# Altium project WCAM-TK-PCB-R02.PrjPcb
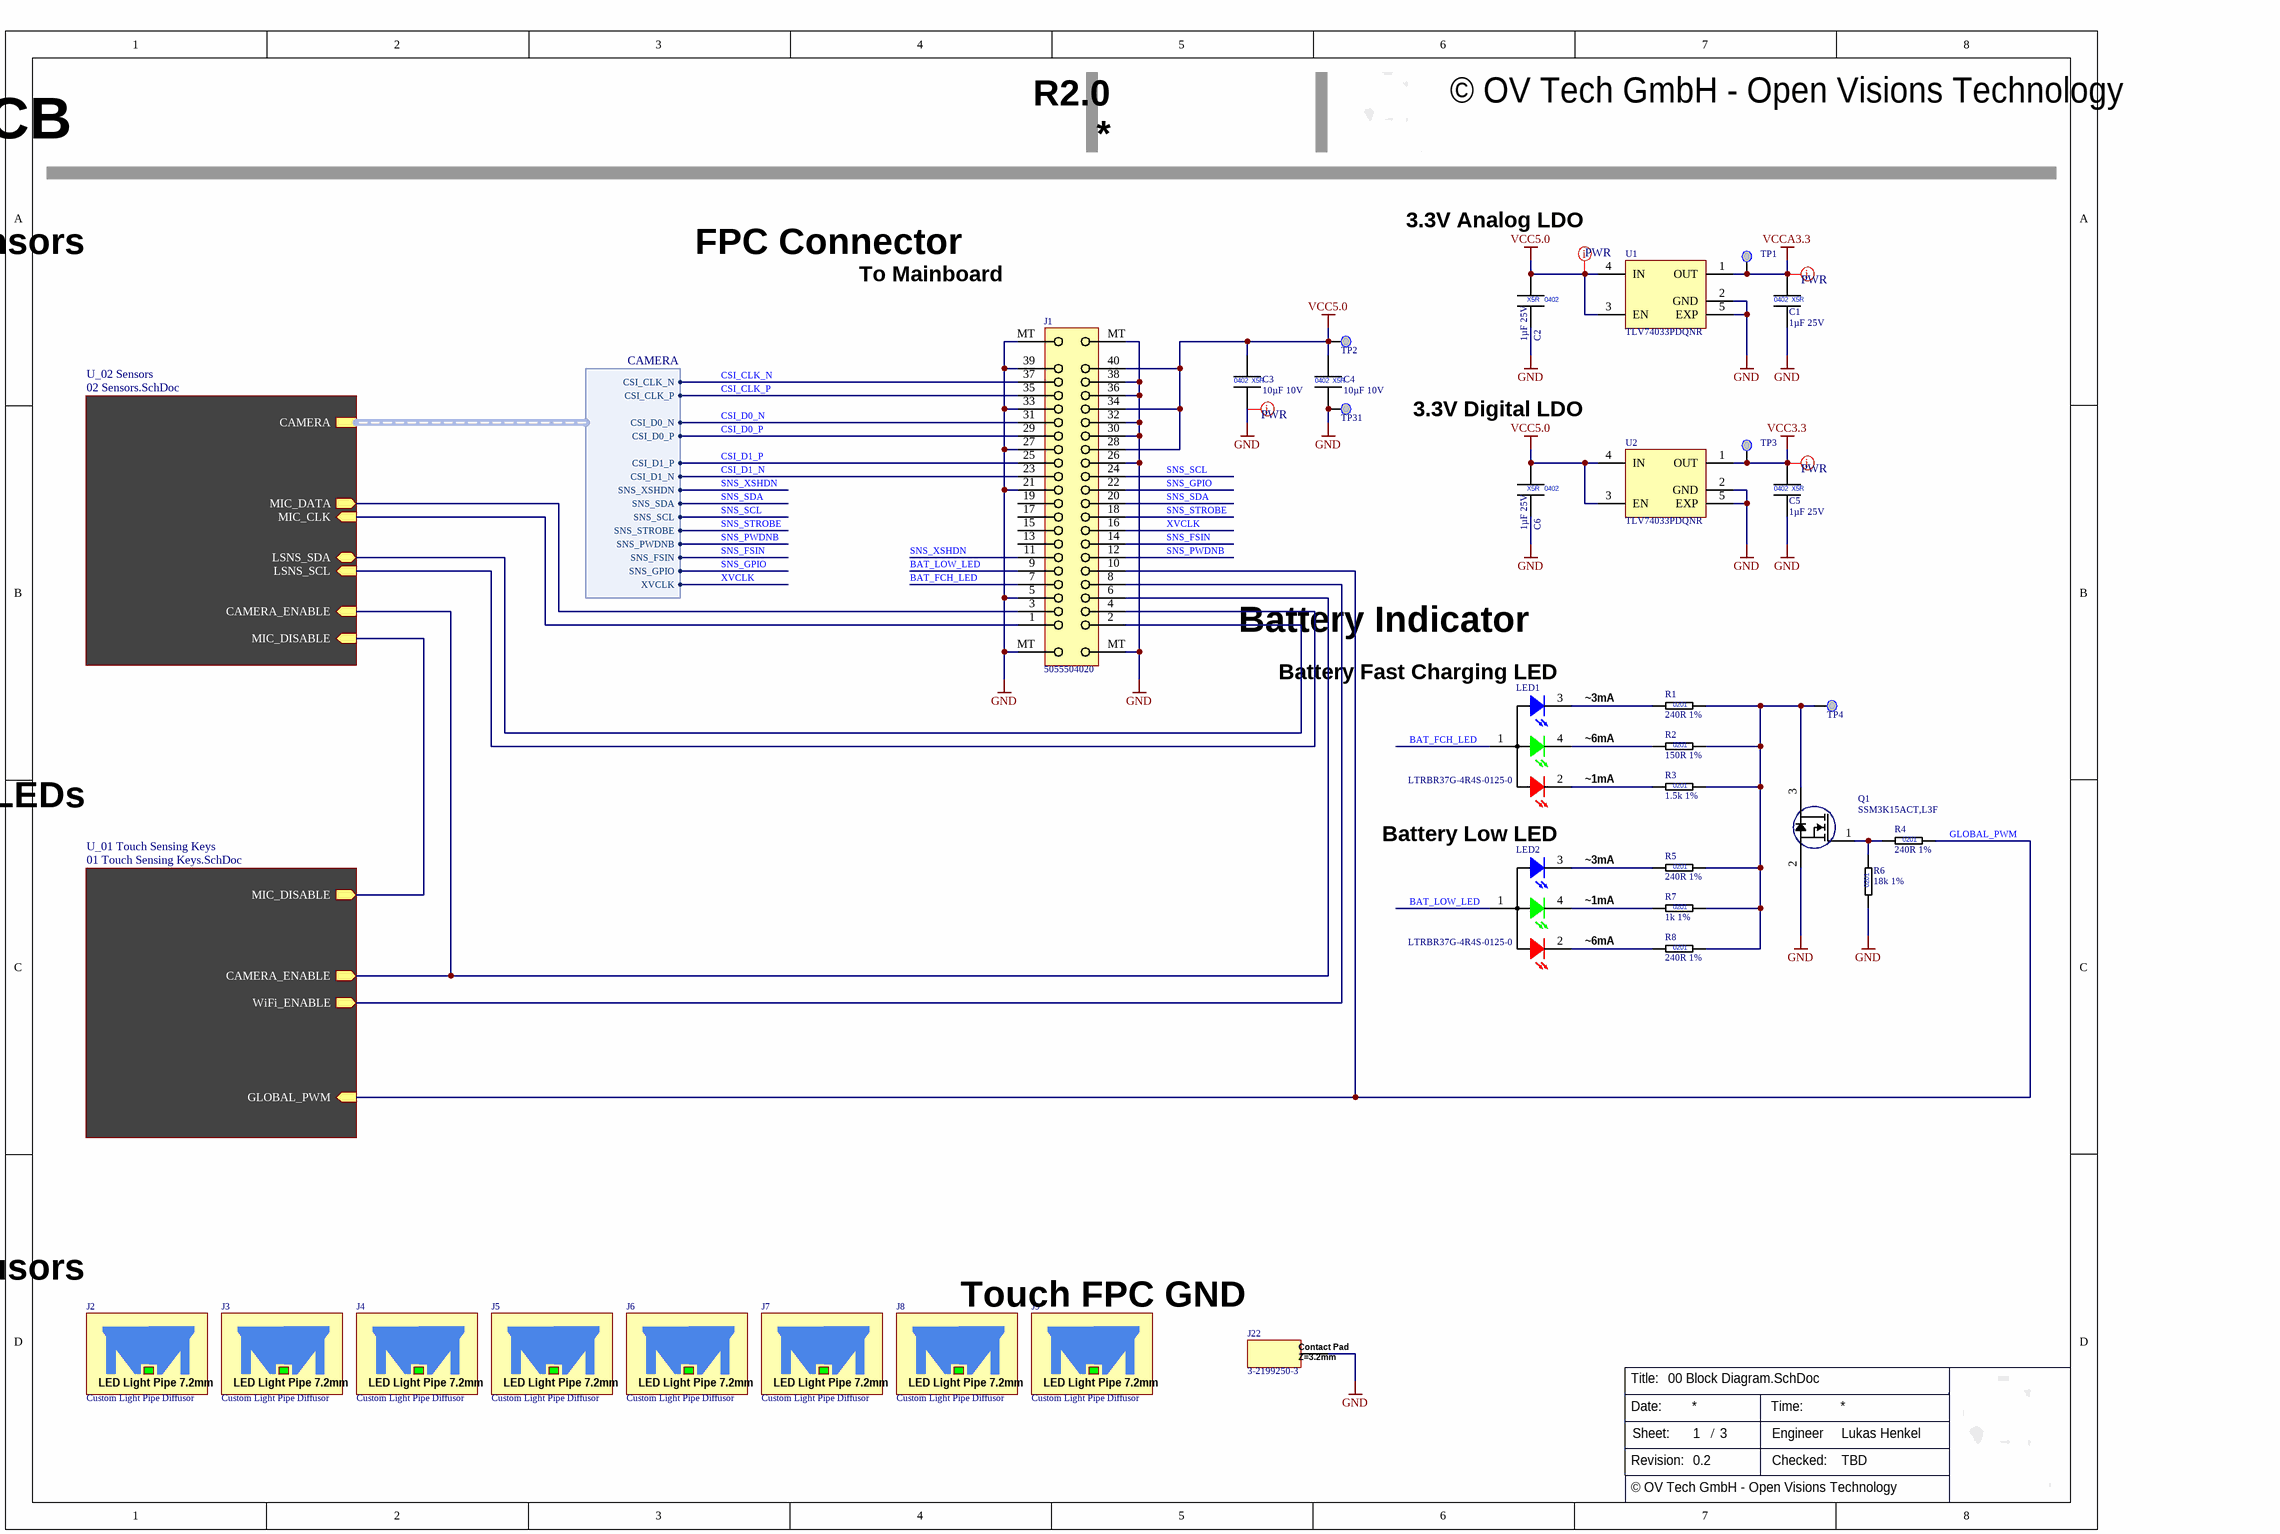
[diagram p0: 00 Block Diagram.SchDoc]
3 sheets, 179 parts. Net scope: hierarchical (ports join the sheet entries above them; power ports are global).
Board files: WCAM-TK-PCB-R02.PcbDoc, WCAM-MOUNT-PCB-R01.PcbDoc, WCAM-TOUCH-FPC-R01.PcbDoc, WCAM-MOUNT-STENCIL-R01.PcbDoc
Sheets:
  00 Block Diagram.SchDoc
    U_01 Touch Sensing Keys = 01 Touch Sensing Keys.SchDoc
    U_02 Sensors = 02 Sensors.SchDoc

## Sheet 00 Block Diagram.SchDoc
size A3; CheckedBy: TBD; Engineer: Lukas Henkel; Revision: 0.2; SheetNumber: 1; SheetTotal: 3

### Parts
C1  1µF 25V  [CAPC1005X06L]
C2  1µF 25V  [CAPC1005X06L]
C3  10µF 10V  [CAPC1005X06L]
C4  10µF 10V  [CAPC1005X06L]
C5  1µF 25V  [CAPC1005X06L]
C6  1µF 25V  [CAPC1005X06L]
J1  5055504020  [BOARD-TO-BOARD 40POL_505550-4020]
J2  Custom Light Pipe Diffusor  [LIGHT_PIPE_DIFFUSOR_CUSTOM]
J3  Custom Light Pipe Diffusor  [LIGHT_PIPE_DIFFUSOR_CUSTOM]
J4  Custom Light Pipe Diffusor  [LIGHT_PIPE_DIFFUSOR_CUSTOM]
J5  Custom Light Pipe Diffusor  [LIGHT_PIPE_DIFFUSOR_CUSTOM]
J6  Custom Light Pipe Diffusor  [LIGHT_PIPE_DIFFUSOR_CUSTOM]
J7  Custom Light Pipe Diffusor  [LIGHT_PIPE_DIFFUSOR_CUSTOM]
J8  Custom Light Pipe Diffusor  [LIGHT_PIPE_DIFFUSOR_CUSTOM]
J9  Custom Light Pipe Diffusor  [LIGHT_PIPE_DIFFUSOR_CUSTOM]
J22  3-2199250-3  [Contact Pad_3.2mm_3-2199250-3]
LED1  LTRBR37G-4R4S-0125-0  [LED 120X120 LTRB R37G RGB]
LED2  LTRBR37G-4R4S-0125-0  [LED 120X120 LTRB R37G RGB]
Q1  SSM3K15ACT,L3F  [DFN65P100X50-3L]
R1  240R 1%  [RESC0603X03L]
R2  150R 1%  [RESC0603X03L]
R3  1.5k 1%  [RESC0603X03L]
R4  240R 1%  [RESC0603X03L]
R5  240R 1%  [RESC0603X03L]
R6  18k 1%  [RESC0603X03L]
R7  1k 1%  [RESC0603X03L]
R8  240R 1%  [RESC0603X03L]
TP1  Testpoint 0.5mm  [TP_0.50mm]  (value not drawn)  (no BOM)
TP2  Testpoint 0.5mm  [TP_0.50mm]  (value not drawn)  (no BOM)
TP3  Testpoint 0.5mm  [TP_0.50mm]  (value not drawn)  (no BOM)
TP4  Testpoint 0.5mm  [TP_0.50mm]  (value not drawn)  (no BOM)
TP31  Testpoint 0.5mm  [TP_0.50mm]  (value not drawn)  (no BOM)
U1  TLV74033PDQNR  [X2SON-DFN]
U2  TLV74033PDQNR  [X2SON-DFN]

### Sub-sheets
U_01 Touch Sensing Keys = 01 Touch Sensing Keys.SchDoc: WiFi_ENABLE (out), MIC_DISABLE (out), GLOBAL_PWM (in), CAMERA_ENABLE (out)
U_02 Sensors = 02 Sensors.SchDoc: MIC_DATA (out), MIC_CLK (in), MIC_DISABLE (in), LSNS_SDA (bidir), LSNS_SCL (in), CAMERA (harness CAMERA), CAMERA_ENABLE (in)

### Harnesses
CAMERA: CSI_D0_N, CSI_D0_P, CSI_D1_N, CSI_D1_P, CSI_CLK_N, CSI_CLK_P, SNS_XSHDN, SNS_SDA, SNS_SCL, SNS_STROBE, SNS_PWDNB, SNS_FSIN, SNS_GPIO, XVCLK

### Nets
GND: C1.2 C2.2 C3.2 C4.2 C5.2 C6.2 J1.5 J1.21 J1.26 J1.27 J1.30 J1.32 J1.33 J1.36 J1.38 J1.39 J1.MT J22.1 Q1.2(S) R6.1 TP31.TP U1.2(GND) U1.5(EXP) U2.2(GND) U2.5(EXP)
VCC3.3: C5.1 TP3.TP U2.1(OUT)
VCC5.0: C2.1 C3.1 C4.1 C6.1 J1.28 J1.34 J1.40 TP2.TP U1.3(EN) U1.4(IN) U2.3(EN) U2.4(IN)
VCCA3.3: C1.1 TP1.TP U1.1(OUT)
BAT_FCH_LED: J1.7 LED1.1
BAT_LOW_LED: J1.9 LED2.1
CAMERA_ENABLE: J1.6 ; sheet U_01 Touch Sensing Keys/CAMERA_ENABLE, sheet U_02 Sensors/CAMERA_ENABLE
CSI_CLK_N: J1.37 ; sheet U_02 Sensors/CAMERA.CSI_CLK_N
CSI_CLK_P: J1.35 ; sheet U_02 Sensors/CAMERA.CSI_CLK_P
CSI_D0_N: J1.31 ; sheet U_02 Sensors/CAMERA.CSI_D0_N
CSI_D0_P: J1.29 ; sheet U_02 Sensors/CAMERA.CSI_D0_P
CSI_D1_N: J1.23 ; sheet U_02 Sensors/CAMERA.CSI_D1_N
CSI_D1_P: J1.25 ; sheet U_02 Sensors/CAMERA.CSI_D1_P
GLOBAL_PWM: J1.10 R4.2 ; sheet U_01 Touch Sensing Keys/GLOBAL_PWM
LSNS_SCL: J1.4 ; sheet U_02 Sensors/LSNS_SCL
LSNS_SDA: J1.2 ; sheet U_02 Sensors/LSNS_SDA
MIC_DISABLE: sheet U_01 Touch Sensing Keys/MIC_DISABLE, sheet U_02 Sensors/MIC_DISABLE
SNS_FSIN: J1.14 ; sheet U_02 Sensors/CAMERA.SNS_FSIN
SNS_GPIO: J1.22 ; sheet U_02 Sensors/CAMERA.SNS_GPIO
SNS_PWDNB: J1.12 ; sheet U_02 Sensors/CAMERA.SNS_PWDNB
SNS_SCL: J1.24 ; sheet U_02 Sensors/CAMERA.SNS_SCL
SNS_SDA: J1.20 ; sheet U_02 Sensors/CAMERA.SNS_SDA
SNS_STROBE: J1.18 ; sheet U_02 Sensors/CAMERA.SNS_STROBE
SNS_XSHDN: J1.11 ; sheet U_02 Sensors/CAMERA.SNS_XSHDN
WiFi_ENABLE: J1.8 ; sheet U_01 Touch Sensing Keys/WiFi_ENABLE
XVCLK: J1.16 ; sheet U_02 Sensors/CAMERA.XVCLK
NetJ1_1: J1.1 ; sheet U_02 Sensors/MIC_CLK
NetJ1_3: J1.3 ; sheet U_02 Sensors/MIC_DATA
NetLED1_2: LED1.2 R3.1
NetLED1_3: LED1.3 R1.1
NetLED1_4: LED1.4 R2.1
NetLED2_2: LED2.2 R8.1
NetLED2_3: LED2.3 R5.1
NetLED2_4: LED2.4 R7.1
NetQ1_1: Q1.1(G) R4.1 R6.2
NetQ1_3: Q1.3(D) R1.2 R2.2 R3.2 R5.2 R7.2 R8.2 TP4.TP

Not connected (* = marked no-connect by the designer): J1 13 15 17 19

### Layout directives
net class PWR: GND, VCC3.3, VCC5.0, VCCA3.3

### Notes on the sheet
- R2.0
- Webcam and TouchKey PCB
- © OV Tech GmbH - Open Visions Technology
- 3.3V Analog LDO
- Sensors
- FPC Connector
- To Mainboard
- 3.3V Digital LDO
- Battery Indicator
- Battery Fast Charging LED
- ~3mA
- ~6mA
- Touch Keys w. LEDs
- ~1mA
- Battery Low LED
- LED Diffusors
- (near J22) Touch FPC GND
- Title:
- Date:
- Time:
- Revision:
- Sheet:
- /
- Engineer
- Checked:
- (in symbol CAP_0402_1µ_25V) 0402; X5R
- (in symbol CAP_0402_10µ_10V) 0402; X5R
- (in symbol LIGHT PIPE_CUSTOM_DIFFUSOR) LED Light Pipe 7.2mm
- (in symbol PAD_3-2199250-3) Contact Pad; Z=3.2mm
- (in symbol RES_0201_1.5k_1%) 0201
- (in symbol RES_0201_1k_1%) 0201
- (in symbol RES_0201_18k_1%) 0201
- (in symbol RES_0201_150R_1%) 0201
- (in symbol RES_0201_240R_1%) 0201

### Library data of the parts
C1 C2 C5 C6 = CAP_0402_1µ_25V: Multilayer Ceramic Capacitors MLCC - SMD/SMT 0402 25VDC; Manufacturer 1: Murata Electronics; Manufacturer 1 Prt. Nr.: GRM155R61E105KE11D; Manufacturer 2 Prt. Nr.: 0402X105K250CT; Manufacturer 2: Walsin
C3 C4 = CAP_0402_10µ_10V: Multilayer Ceramic Capacitors MLCC - SMD/SMT 0402 10VDC; Manufacturer 1: Murata Electronics; Manufacturer 1 Prt. Nr.: GRM155R61A475MEAAD; Manufacturer 2 Prt. Nr.: LMK105BBJ475MVLF; Manufacturer 2: Taiyo Yuden
J1 = Board to Board Connector_5055504020: Board to Board connector 40Pol Stacking Header 0.4mm Pitch; Manufacturer 1: Molex; Manufacturer 1 Prt. Nr.: 505550-4020
J2-J9 = LIGHT PIPE_CUSTOM_DIFFUSOR: Low Profile LED light pipe diffusor; Manufacturer 1: OV Tech; Manufacturer 1 Prt. Nr.: Light Pipe 7.2mm
J22 = PAD_3-2199250-3: SMD Contact pad spring loaded 3.2mm; Manufacturer 1: TE Connectivity; Manufacturer 1 Prt. Nr.: 3-2199250-3
LED1 LED2 = LED RGB Low Profile_LTRBR37G-4R4S-0125-0: Micro LED Ultra Low Profile 1.2mm X 1.2mm X 0.25mm LTRBR37G; Manufacturer 1: ams OSRAM; Manufacturer 1 Prt. Nr.: LTRBR37G-4R4S-0125-0
Q1 = N-Channel MOSFET_SSM3K15ACT,L3F: MOSFET 30V SGL N-CH TRENCHMOS Logic Level; Manufacturer 1: Toshiba; Manufacturer 1 Prt. Nr.: SSM3K15ACT,L3F
R1 R4 R5 R8 = RES_0201_240R_1%: Thick Film Resistors - SMD 240 OHM 1%; Manufacturer 1: Yageo; Manufacturer 1 Prt. Nr.: RC0201FR-07240RL; Manufacturer 2 Prt. Nr.: CRCW0201240RFNED; Manufacturer 2: Vishay / Dale
R2 = RES_0201_150R_1%: Thick Film Resistors - SMD 150 OHM 1%; Manufacturer 1: Yageo; Manufacturer 1 Prt. Nr.: RC0201FR-07150RL; Manufacturer 2 Prt. Nr.: CRCW0201150RFNED; Manufacturer 2: Vishay / Dale
R3 = RES_0201_1.5k_1%: Thick Film Resistors - SMD 1.5K OHM 1%; Manufacturer 1: Yageo; Manufacturer 1 Prt. Nr.: RC0201FR-071K5L; Manufacturer 2 Prt. Nr.: CRCW02011K50FNED; Manufacturer 2: Vishay / Dale
R6 = RES_0201_18k_1%: Thick Film Resistors - SMD 18K OHM 1%; Manufacturer 1: Panasonic; Manufacturer 1 Prt. Nr.: ERJ-1GNF1802C; Manufacturer 2 Prt. Nr.: RK73H1HTTC1802F; Manufacturer 2: KOA Speer
R7 = RES_0201_1k_1%: Thick Film Resistors - SMD 1K OHM 1%; Manufacturer 1: Yageo; Manufacturer 1 Prt. Nr.: RC0201FR-071KL; Manufacturer 2 Prt. Nr.: CRCW02011K00FNED; Manufacturer 2: Vishay / Dale
U1 U2 = LDO 3.3V_TLV74033PDQNR: LDO voltage regulator 300mA X2SON; Manufacturer 1: Texas Instruments; Manufacturer 1 Prt. Nr.: TLV74033PDQNR

## Sheet 01 Touch Sensing Keys.SchDoc
size A3; CheckedBy: TBD; Engineer: Lukas Henkel; Revision: 0.2; SheetNumber: 2; SheetTotal: 3
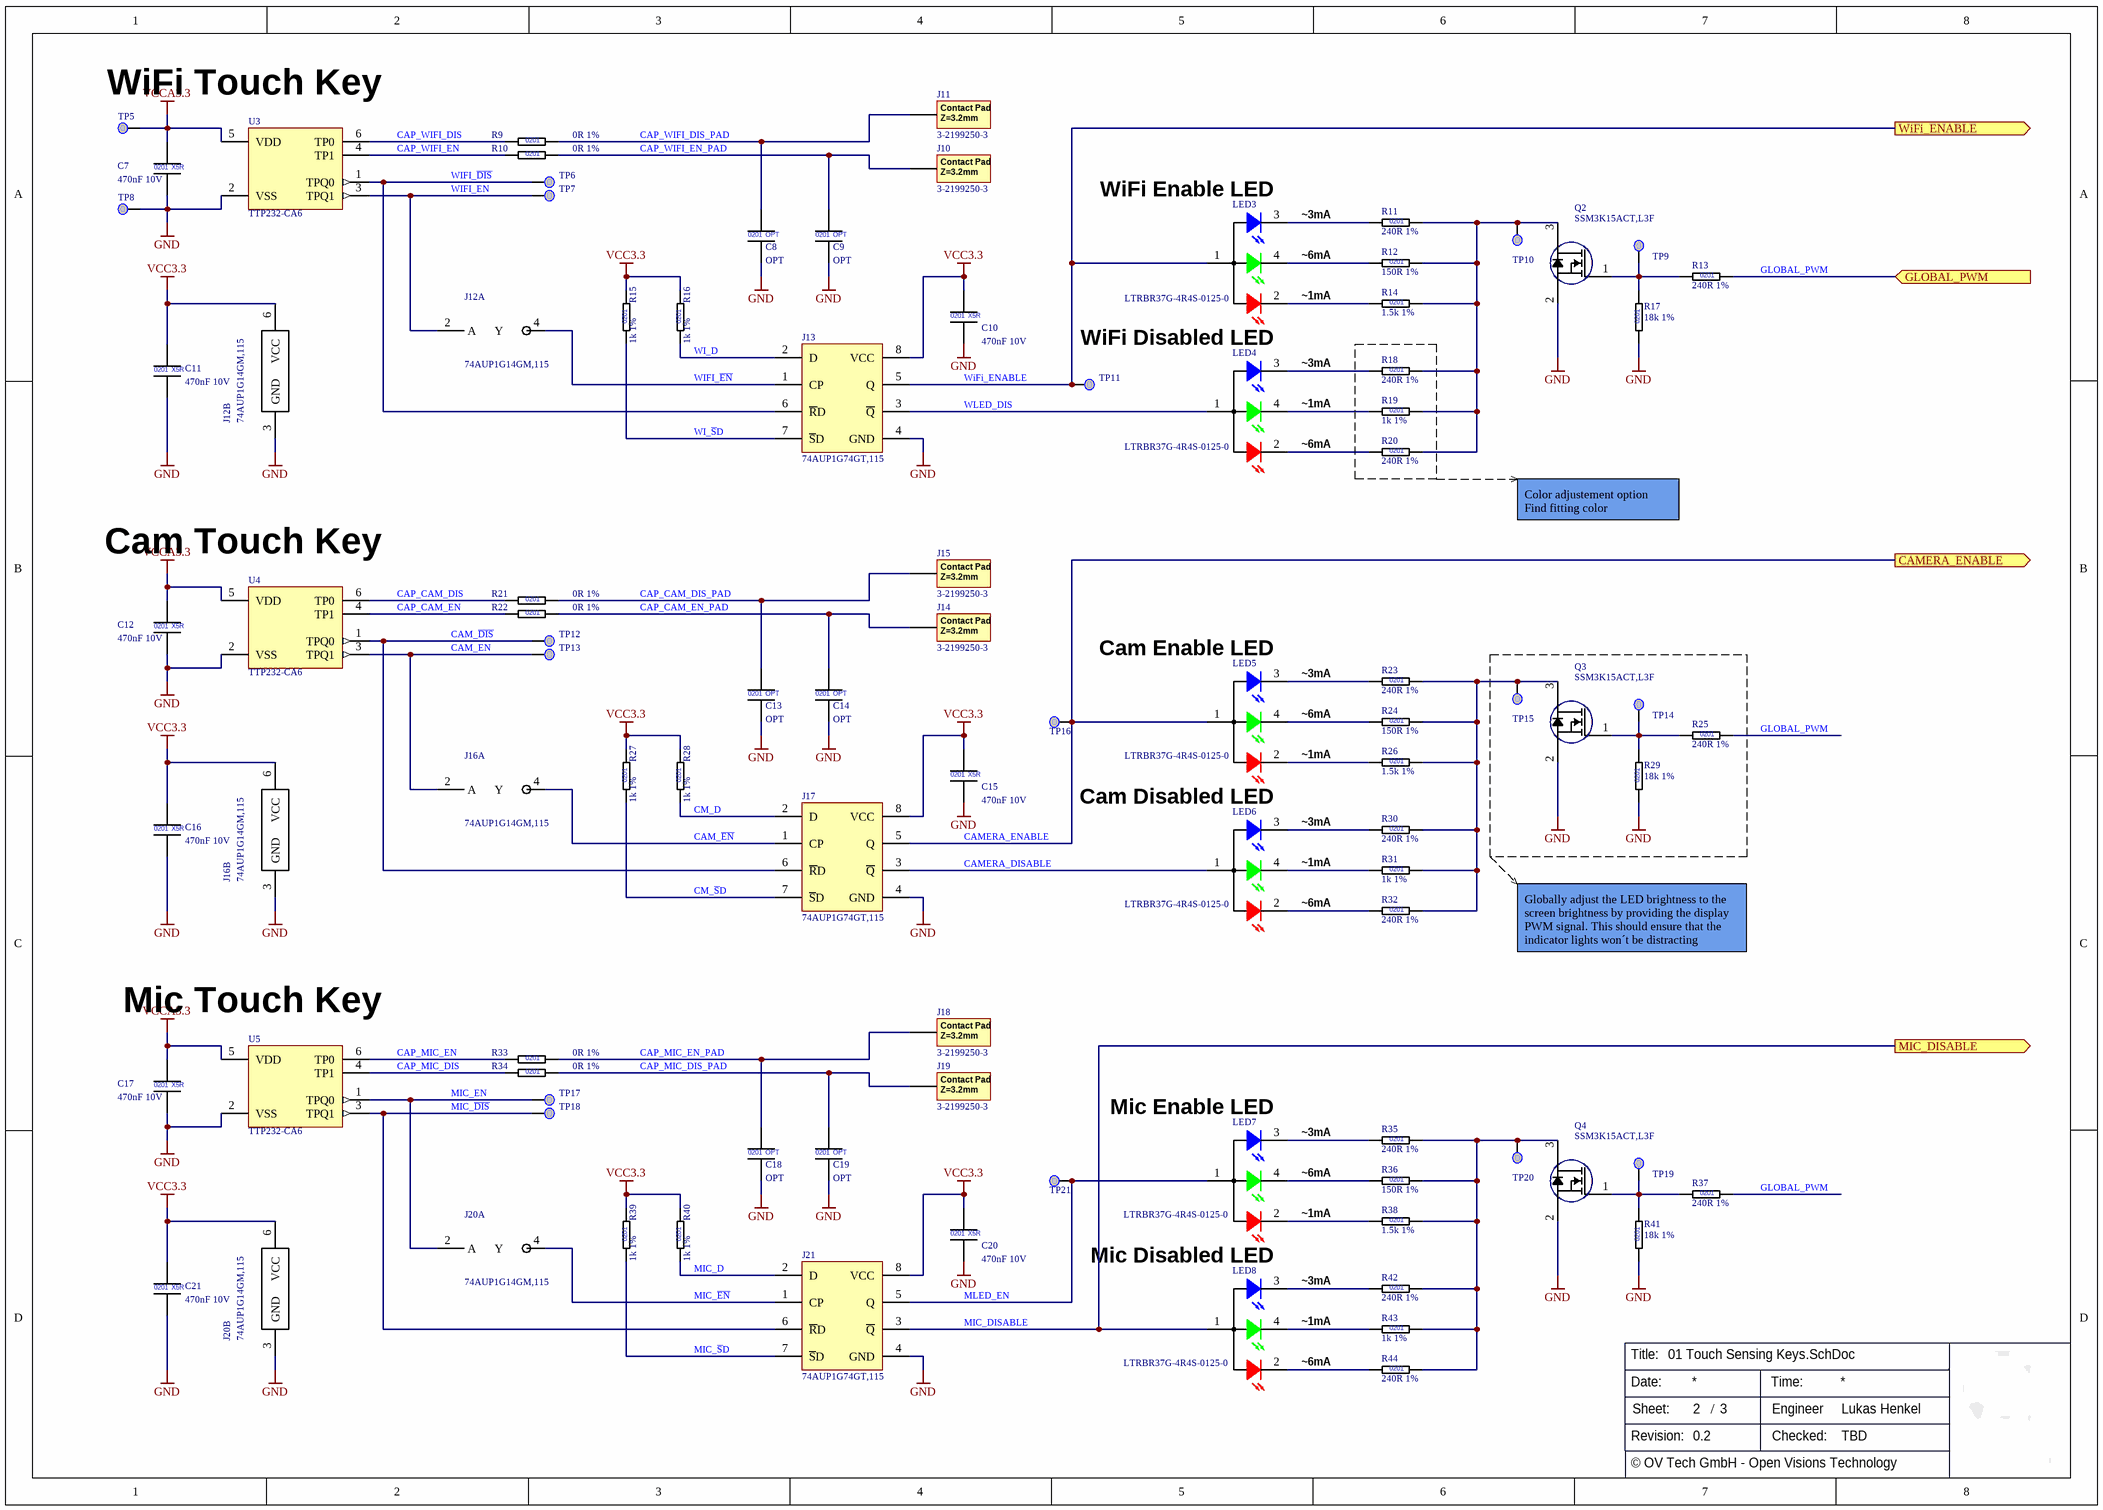
[diagram p1: 01 Touch Sensing Keys.SchDoc]

### Parts
C7  470nF 10V  [CAPC0603X03L]
C8  OPT  [CAPC0603X03L]  (no BOM)
C9  OPT  [CAPC0603X03L]  (no BOM)
C10  470nF 10V  [CAPC0603X03L]
C11  470nF 10V  [CAPC0603X03L]
C12  470nF 10V  [CAPC0603X03L]
C13  OPT  [CAPC0603X03L]  (no BOM)
C14  OPT  [CAPC0603X03L]  (no BOM)
C15  470nF 10V  [CAPC0603X03L]
C16  470nF 10V  [CAPC0603X03L]
C17  470nF 10V  [CAPC0603X03L]
C18  OPT  [CAPC0603X03L]  (no BOM)
C19  OPT  [CAPC0603X03L]  (no BOM)
C20  470nF 10V  [CAPC0603X03L]
C21  470nF 10V  [CAPC0603X03L]
J10  3-2199250-3  [Contact Pad_3.2mm_3-2199250-3]
J11  3-2199250-3  [Contact Pad_3.2mm_3-2199250-3]
J12  74AUP1G14GM,115  [PSON50P140X100X50-6L]  (parts A,B of 2)
J13  74AUP1G74GT,115  [PSON50P100X50-8L]
J14  3-2199250-3  [Contact Pad_3.2mm_3-2199250-3]
J15  3-2199250-3  [Contact Pad_3.2mm_3-2199250-3]
J16  74AUP1G14GM,115  [PSON50P140X100X50-6L]  (parts A,B of 2)
J17  74AUP1G74GT,115  [PSON50P100X50-8L]
J18  3-2199250-3  [Contact Pad_3.2mm_3-2199250-3]
J19  3-2199250-3  [Contact Pad_3.2mm_3-2199250-3]
J20  74AUP1G14GM,115  [PSON50P140X100X50-6L]  (parts A,B of 2)
J21  74AUP1G74GT,115  [PSON50P100X50-8L]
LED3  LTRBR37G-4R4S-0125-0  [LED 120X120 LTRB R37G RGB]
LED4  LTRBR37G-4R4S-0125-0  [LED 120X120 LTRB R37G RGB]
LED5  LTRBR37G-4R4S-0125-0  [LED 120X120 LTRB R37G RGB]
LED6  LTRBR37G-4R4S-0125-0  [LED 120X120 LTRB R37G RGB]
LED7  LTRBR37G-4R4S-0125-0  [LED 120X120 LTRB R37G RGB]
LED8  LTRBR37G-4R4S-0125-0  [LED 120X120 LTRB R37G RGB]
Q2  SSM3K15ACT,L3F  [DFN65P100X50-3L]
Q3  SSM3K15ACT,L3F  [DFN65P100X50-3L]
Q4  SSM3K15ACT,L3F  [DFN65P100X50-3L]
R9  0R 1%  [RESC0603X03L]
R10  0R 1%  [RESC0603X03L]
R11  240R 1%  [RESC0603X03L]
R12  150R 1%  [RESC0603X03L]
R13  240R 1%  [RESC0603X03L]
R14  1.5k 1%  [RESC0603X03L]
R15  1k 1%  [RESC0603X03L]
R16  1k 1%  [RESC0603X03L]
R17  18k 1%  [RESC0603X03L]
R18  240R 1%  [RESC0603X03L]
R19  1k 1%  [RESC0603X03L]
R20  240R 1%  [RESC0603X03L]
R21  0R 1%  [RESC0603X03L]
R22  0R 1%  [RESC0603X03L]
R23  240R 1%  [RESC0603X03L]
R24  150R 1%  [RESC0603X03L]
R25  240R 1%  [RESC0603X03L]
R26  1.5k 1%  [RESC0603X03L]
R27  1k 1%  [RESC0603X03L]
R28  1k 1%  [RESC0603X03L]
R29  18k 1%  [RESC0603X03L]
R30  240R 1%  [RESC0603X03L]
R31  1k 1%  [RESC0603X03L]
R32  240R 1%  [RESC0603X03L]
R33  0R 1%  [RESC0603X03L]
R34  0R 1%  [RESC0603X03L]
R35  240R 1%  [RESC0603X03L]
R36  150R 1%  [RESC0603X03L]
R37  240R 1%  [RESC0603X03L]
R38  1.5k 1%  [RESC0603X03L]
R39  1k 1%  [RESC0603X03L]
R40  1k 1%  [RESC0603X03L]
R41  18k 1%  [RESC0603X03L]
R42  240R 1%  [RESC0603X03L]
R43  1k 1%  [RESC0603X03L]
R44  240R 1%  [RESC0603X03L]
TP5  Testpoint 0.5mm  [TP_0.50mm]  (value not drawn)  (no BOM)
TP6  Testpoint 0.5mm  [TP_0.50mm]  (value not drawn)  (no BOM)
TP7  Testpoint 0.5mm  [TP_0.50mm]  (value not drawn)  (no BOM)
TP8  Testpoint 0.5mm  [TP_0.50mm]  (value not drawn)  (no BOM)
TP9  Testpoint 0.5mm  [TP_0.50mm]  (value not drawn)  (no BOM)
TP10  Testpoint 0.5mm  [TP_0.50mm]  (value not drawn)  (no BOM)
TP11  Testpoint 0.5mm  [TP_0.50mm]  (value not drawn)  (no BOM)
TP12  Testpoint 0.5mm  [TP_0.50mm]  (value not drawn)  (no BOM)
TP13  Testpoint 0.5mm  [TP_0.50mm]  (value not drawn)  (no BOM)
TP14  Testpoint 0.5mm  [TP_0.50mm]  (value not drawn)  (no BOM)
TP15  Testpoint 0.5mm  [TP_0.50mm]  (value not drawn)  (no BOM)
TP16  Testpoint 0.5mm  [TP_0.50mm]  (value not drawn)  (no BOM)
TP17  Testpoint 0.5mm  [TP_0.50mm]  (value not drawn)  (no BOM)
TP18  Testpoint 0.5mm  [TP_0.50mm]  (value not drawn)  (no BOM)
TP19  Testpoint 0.5mm  [TP_0.50mm]  (value not drawn)  (no BOM)
TP20  Testpoint 0.5mm  [TP_0.50mm]  (value not drawn)  (no BOM)
TP21  Testpoint 0.5mm  [TP_0.50mm]  (value not drawn)  (no BOM)
U3  TTP232-CA6  [SOT95P285X126-6L]
U4  TTP232-CA6  [SOT95P285X126-6L]
U5  TTP232-CA6  [SOT95P285X126-6L]

### Ports
CAMERA_ENABLE (out), GLOBAL_PWM (in), MIC_DISABLE (out), WiFi_ENABLE (out)

### Nets
GND: C7.2 C8.2 C9.2 C10.2 C11.2 C12.2 C13.2 C14.2 C15.2 C16.2 C17.2 C18.2 C19.2 C20.2 C21.2 J12.3(GND) J13.4(GND) J16.3(GND) J17.4(GND) J20.3(GND) J21.4(GND) Q2.2(S) Q3.2(S) Q4.2(S) R17.1 R29.1 R41.1 TP8.TP U3.2(VSS) U4.2(VSS) U5.2(VSS)
VCC3.3: C10.1 C11.1 C15.1 C16.1 C20.1 C21.1 J12.6(VCC) J13.8(VCC) J16.6(VCC) J17.8(VCC) J20.6(VCC) J21.8(VCC) R15.2 R16.2 R27.2 R28.2 R39.2 R40.2
VCCA3.3: C7.1 C12.1 C17.1 TP5.TP U3.5(VDD) U4.5(VDD) U5.5(VDD)
CAM_~{DIS}: J17.6(~{R}D) TP12.TP U4.1(TPQ0)
CAM_~{EN}: J16.4(Y) J17.1(CP)
CAM_EN: J16.2(A) TP13.TP U4.3(TPQ1)
CAMERA_DISABLE: J17.3(~{Q}) LED6.1
CAMERA_ENABLE: J17.5(Q) LED5.1 TP16.TP ; port CAMERA_ENABLE
CAP_CAM_DIS: R21.1 U4.6(TP0)
CAP_CAM_DIS_PAD: C13.1 J15.1 R21.2
CAP_CAM_EN: R22.1 U4.4(TP1)
CAP_CAM_EN_PAD: C14.1 J14.1 R22.2
CAP_MIC_DIS: R34.1 U5.4(TP1)
CAP_MIC_DIS_PAD: C19.1 J19.1 R34.2
CAP_MIC_EN: R33.1 U5.6(TP0)
CAP_MIC_EN_PAD: C18.1 J18.1 R33.2
CAP_WIFI_DIS: R9.1 U3.6(TP0)
CAP_WIFI_DIS_PAD: C8.1 J11.1 R9.2
CAP_WIFI_EN: R10.1 U3.4(TP1)
CAP_WIFI_EN_PAD: C9.1 J10.1 R10.2
CM_D: J17.2(D) R28.1
CM_~{S}D: J17.7(~{S}D) R27.1
GLOBAL_PWM: R13.2 R25.2 R37.2 ; port GLOBAL_PWM
MIC_D: J21.2(D) R40.1
MIC_~{DIS}: J21.6(~{R}D) TP18.TP U5.3(TPQ1)
MIC_DISABLE: J21.3(~{Q}) LED8.1 ; port MIC_DISABLE
MIC_~{EN}: J20.4(Y) J21.1(CP)
MIC_EN: J20.2(A) TP17.TP U5.1(TPQ0)
MIC_~{S}D: J21.7(~{S}D) R39.1
MLED_EN: J21.5(Q) LED7.1 TP21.TP
WI_D: J13.2(D) R16.1
WI_~{S}D: J13.7(~{S}D) R15.1
WIFI_~{DIS}: J13.6(~{R}D) TP6.TP U3.1(TPQ0)
WIFI_~{EN}: J12.4(Y) J13.1(CP)
WIFI_EN: J12.2(A) TP7.TP U3.3(TPQ1)
WiFi_ENABLE: J13.5(Q) LED3.1 TP11.TP ; port WiFi_ENABLE
WLED_DIS: J13.3(~{Q}) LED4.1
NetLED3_2: LED3.2 R14.1
NetLED3_3: LED3.3 R11.1
NetLED3_4: LED3.4 R12.1
NetLED4_2: LED4.2 R20.1
NetLED4_3: LED4.3 R18.1
NetLED4_4: LED4.4 R19.1
NetLED5_2: LED5.2 R26.1
NetLED5_3: LED5.3 R23.1
NetLED5_4: LED5.4 R24.1
NetLED6_2: LED6.2 R32.1
NetLED6_3: LED6.3 R30.1
NetLED6_4: LED6.4 R31.1
NetLED7_2: LED7.2 R38.1
NetLED7_3: LED7.3 R35.1
NetLED7_4: LED7.4 R36.1
NetLED8_2: LED8.2 R44.1
NetLED8_3: LED8.3 R42.1
NetLED8_4: LED8.4 R43.1
NetQ2_1: Q2.1(G) R13.1 R17.2 TP9.TP
NetQ2_3: Q2.3(D) R11.2 R12.2 R14.2 R18.2 R19.2 R20.2 TP10.TP
NetQ3_1: Q3.1(G) R25.1 R29.2 TP14.TP
NetQ3_3: Q3.3(D) R23.2 R24.2 R26.2 R30.2 R31.2 R32.2 TP15.TP
NetQ4_1: Q4.1(G) R37.1 R41.2 TP19.TP
NetQ4_3: Q4.3(D) R35.2 R36.2 R38.2 R42.2 R43.2 R44.2 TP20.TP

### Notes on the sheet
- WiFi Touch Key
- WiFi Enable LED
- ~3mA
- WiFi Disabled LED
- ~6mA
- ~1mA
- Cam Touch Key
- Color adjustement option
  Find fitting color experimentally
- Cam Enable LED
- Cam Disabled LED
- Mic Touch Key
- Globally adjust the LED brightness to the screen brightness by providing the display PWM signal. This should ensure that the indicator lights won´t be distracting
- Mic Enable LED
- Mic Disabled LED
- Title:
- Date:
- Time:
- Revision:
- Sheet:
- /
- Engineer
- Checked:
- © OV Tech GmbH - Open Visions Technology
- (in symbol CAP_0201_470nF_10V) 0201; X5R
- (in symbol CAP_0201_OPT) 0201
- (in symbol PAD_3-2199250-3) Contact Pad; Z=3.2mm
- (in symbol RES_0201_0R_1%) 0201
- (in symbol RES_0201_1.5k_1%) 0201
- (in symbol RES_0201_1k_1%) 0201
- (in symbol RES_0201_18k_1%) 0201
- (in symbol RES_0201_150R_1%) 0201
- (in symbol RES_0201_240R_1%) 0201

### Library data of the parts
C7 C10-C12 C15-C17 C20 C21 = CAP_0201_470nF_10V: Multilayer Ceramic Capacitors MLCC - SMD/SMT 0201 10VDC; Manufacturer 1: Taiyo Yuden; Manufacturer 1 Prt. Nr.: LMK063BBJ474KPLF; Manufacturer 2 Prt. Nr.: C0603X5R1A474M030BC; Manufacturer 2: TDK
C8 C9 C13 C14 C18 C19 = CAP_0201_OPT: Optional Capacitor 0201
J10 J11 J14 J15 J18 J19 = PAD_3-2199250-3: as J22 on sheet 00 Block Diagram; Manufacturer 1 Prt. Nr.: 3-2199250-3
J12 J16 J20 = Inverter_74AUP1G14GM,115: Single Unbuffered Inverter 74AUP1G14GM,115; Manufacturer 1: Nexperia; Manufacturer 1 Prt. Nr.: 74AUP1G14GM,115
J13 J17 J21 = D-FLOP_SMG-W-2,0x1,2x1,25-AU: D-type flip-flop with differential output and async set- and reset input; Manufacturer 1: Nexperia; Manufacturer 1 Prt. Nr.: 74AUP1G74GT,115
LED3-LED8 = LED RGB Low Profile_LTRBR37G-4R4S-0125-0: as LED1 on sheet 00 Block Diagram; Manufacturer 1 Prt. Nr.: LTRBR37G-4R4S-0125-0
Q2-Q4 = N-Channel MOSFET_SSM3K15ACT,L3F: as Q1 on sheet 00 Block Diagram; Manufacturer 1 Prt. Nr.: SSM3K15ACT,L3F
R9 R10 R21 R22 R33 R34 = RES_0201_0R_1%: Thick Film Resistors - SMD 0R OHM 1%; Manufacturer 1: Yageo; Manufacturer 1 Prt. Nr.: RC0201FR-070RL; Manufacturer 2 Prt. Nr.: CRCW02010000Z0ED; Manufacturer 2: Vishay / Dale
R11 R13 R18 R20 R23 R25 R30 R32 R35 R37 R42 R44 = RES_0201_240R_1%: as R1 on sheet 00 Block Diagram; Manufacturer 2: Vishay / Dale
R12 R24 R36 = RES_0201_150R_1%: as R2 on sheet 00 Block Diagram; Manufacturer 2: Vishay / Dale
R14 R26 R38 = RES_0201_1.5k_1%: as R3 on sheet 00 Block Diagram; Manufacturer 2: Vishay / Dale
R15 R16 R19 R27 R28 R31 R39 R40 R43 = RES_0201_1k_1%: as R7 on sheet 00 Block Diagram; Manufacturer 2: Vishay / Dale
R17 R29 R41 = RES_0201_18k_1%: as R6 on sheet 00 Block Diagram; Manufacturer 2: KOA Speer
U3-U5 = Dual key capacitive touch sensing_TTP232-CA6: Two key touch pad detector IC TTP232-CA6; Manufacturer 1: Tontek Design Tech; Manufacturer 1 Prt. Nr.: TTP232-CA6

## Sheet 02 Sensors.SchDoc
size A3; CheckedBy: TBD; Engineer: Lukas Henkel; Revision: 0.2; SheetNumber: 3; SheetTotal: 3
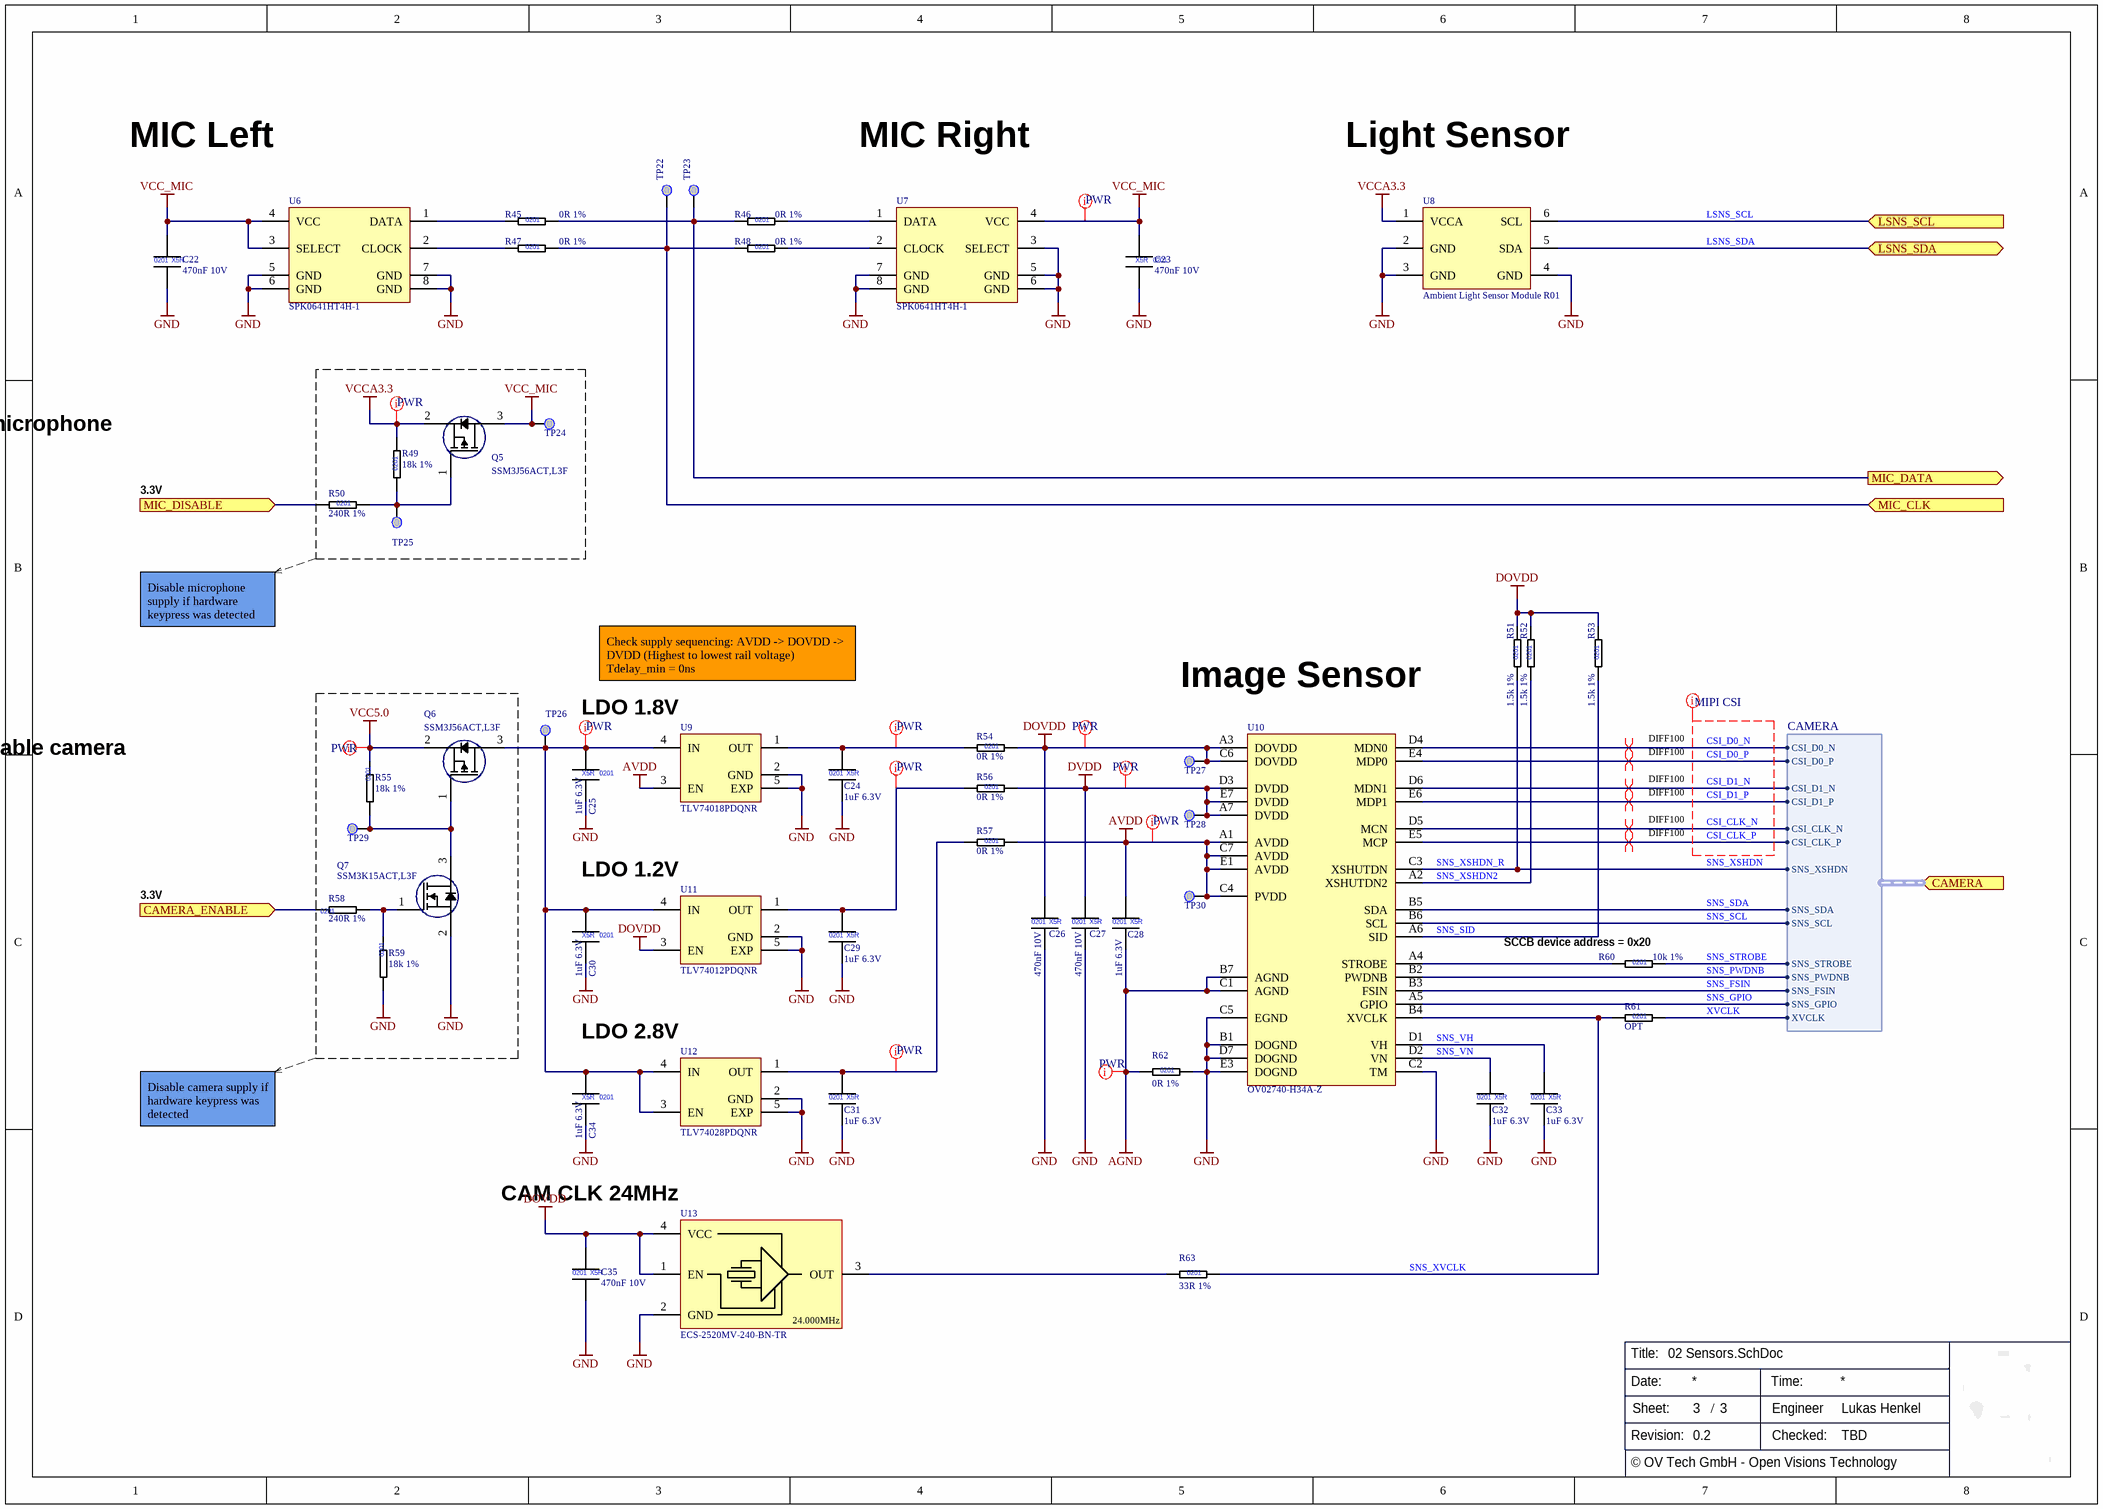
[diagram p2: 02 Sensors.SchDoc]

### Parts
C22  470nF 10V  [CAPC0603X03L]
C23  470nF 10V  [CAPC0603X03L]
C24  1uF 6.3V  [CAPC0603X03L]
C25  1uF 6.3V  [CAPC0603X03L]
C26  470nF 10V  [CAPC0603X03L]
C27  470nF 10V  [CAPC0603X03L]
C28  1uF 6.3V  [CAPC0603X03L]
C29  1uF 6.3V  [CAPC0603X03L]
C30  1uF 6.3V  [CAPC0603X03L]
C31  1uF 6.3V  [CAPC0603X03L]
C32  1uF 6.3V  [CAPC0603X03L]
C33  1uF 6.3V  [CAPC0603X03L]
C34  1uF 6.3V  [CAPC0603X03L]
C35  470nF 10V  [CAPC0603X03L]
Q5  SSM3J56ACT,L3F  [DFN65P100X50-3L]
Q6  SSM3J56ACT,L3F  [DFN65P100X50-3L]
Q7  SSM3K15ACT,L3F  [DFN65P100X50-3L]
R45  0R 1%  [RESC0603X03L]
R46  0R 1%  [RESC0603X03L]
R47  0R 1%  [RESC0603X03L]
R48  0R 1%  [RESC0603X03L]
R49  18k 1%  [RESC0603X03L]
R50  240R 1%  [RESC0603X03L]
R51  1.5k 1%  [RESC0603X03L]
R52  1.5k 1%  [RESC0603X03L]
R53  1.5k 1%  [RESC0603X03L]
R54  0R 1%  [RESC0603X03L]
R55  18k 1%  [RESC0603X03L]
R56  0R 1%  [RESC0603X03L]
R57  0R 1%  [RESC0603X03L]
R58  240R 1%  [RESC0603X03L]
R59  18k 1%  [RESC0603X03L]
R60  10k 1%  [RESC0603X03L]
R61  OPT  [RESC0603X03L]  (no BOM)
R62  0R 1%  [RESC0603X03L]
R63  33R 1%  [RESC0603X03L]
TP22  Testpoint 0.5mm  [TP_0.50mm]  (value not drawn)  (no BOM)
TP23  Testpoint 0.5mm  [TP_0.50mm]  (value not drawn)  (no BOM)
TP24  Testpoint 0.5mm  [TP_0.50mm]  (value not drawn)  (no BOM)
TP25  Testpoint 0.5mm  [TP_0.50mm]  (value not drawn)  (no BOM)
TP26  Testpoint 0.5mm  [TP_0.50mm]  (value not drawn)  (no BOM)
TP27  Testpoint 0.5mm  [TP_0.50mm]  (value not drawn)  (no BOM)
TP28  Testpoint 0.5mm  [TP_0.50mm]  (value not drawn)  (no BOM)
TP29  Testpoint 0.5mm  [TP_0.50mm]  (value not drawn)  (no BOM)
TP30  Testpoint 0.5mm  [TP_0.50mm]  (value not drawn)  (no BOM)
U6  SPK0641HT4H-1  [MIC_SPK0641HT4H-1]
U7  SPK0641HT4H-1  [MIC_SPK0641HT4H-1]
U8  Ambient Light Sensor Module R01  [ABLS-R01-ambient light sensor module]
U9  TLV74018PDQNR  [X2SON-DFN]
U10  OV02740-H34A-Z  [BGA34C53P7X5_386X292X388]
U11  TLV74012PDQNR  [X2SON-DFN]
U12  TLV74028PDQNR  [X2SON-DFN]
U13  ECS-2520MV-240-BN-TR  [Oscillator_ECS-2520MV]

### Ports
CAMERA (in, harness CAMERA), CAMERA_ENABLE (in), LSNS_SCL (in), LSNS_SDA (bidir), MIC_CLK (in), MIC_DATA (out), MIC_DISABLE (in)

### Harnesses
CAMERA: CSI_D0_N, CSI_D0_P, CSI_D1_N, CSI_D1_P, CSI_CLK_N, CSI_CLK_P, SNS_XSHDN, SNS_SDA, SNS_SCL, SNS_STROBE, SNS_PWDNB, SNS_FSIN, SNS_GPIO, XVCLK

### Nets
AGND: C28.2 R62.1 U10.B7(AGND) U10.C1(AGND)
AVDD: C28.1 R57.2 TP30.TP U9.3(EN) U10.A1(AVDD) U10.C4(PVDD) U10.C7(AVDD) U10.E1(AVDD)
DOVDD: C26.1 C35.1 R51.2 R52.2 R53.2 R54.2 TP27.TP U10.A3(DOVDD) U10.C6(DOVDD) U11.3(EN) U13.1(EN) U13.4(VCC)
DVDD: C27.1 R56.2 TP28.TP U10.A7(DVDD) U10.D3(DVDD) U10.E7(DVDD)
GND: C22.2 C23.2 C24.2 C25.2 C26.2 C27.2 C29.2 C30.2 C31.2 C32.2 C33.2 C34.2 C35.2 Q7.2(S) R59.2 R62.2 U6.5(GND) U6.6(GND) U6.7(GND) U6.8(GND) U7.3(SELECT) U7.5(GND) U7.6(GND) U7.7(GND) U7.8(GND) U8.2(GND) U8.3(GND) U8.4(GND) U9.2(GND) U9.5(EXP) U10.B1(DOGND) U10.C2(TM) U10.C5(EGND) U10.D7(DOGND) U10.E3(DOGND) U11.2(GND) U11.5(EXP) U12.2(GND) U12.5(EXP) U13.2(GND)
VCC5.0: Q6.2(S) R55.1
VCC_MIC: C22.1 C23.1 Q5.3(D) TP24.TP U6.3(SELECT) U6.4(VCC) U7.4(VCC)
VCCA3.3: Q5.2(S) R49.2 U8.1(VCCA)
CAMERA_ENABLE: R58.1 ; port CAMERA_ENABLE
CSI_CLK_N: U10.D5(MCN) ; port CAMERA.CSI_CLK_N
CSI_CLK_P: U10.E5(MCP) ; port CAMERA.CSI_CLK_P
CSI_D0_N: U10.D4(MDN0) ; port CAMERA.CSI_D0_N
CSI_D0_P: U10.E4(MDP0) ; port CAMERA.CSI_D0_P
CSI_D1_N: U10.D6(MDN1) ; port CAMERA.CSI_D1_N
CSI_D1_P: U10.E6(MDP1) ; port CAMERA.CSI_D1_P
LSNS_SCL: U8.6(SCL) ; port LSNS_SCL
LSNS_SDA: U8.5(SDA) ; port LSNS_SDA
MIC_DISABLE: R50.1 ; port MIC_DISABLE
SNS_FSIN: U10.B3(FSIN) ; port CAMERA.SNS_FSIN
SNS_GPIO: U10.A5(GPIO) ; port CAMERA.SNS_GPIO
SNS_PWDNB: U10.B2(PWDNB) ; port CAMERA.SNS_PWDNB
SNS_SCL: U10.B6(SCL) ; port CAMERA.SNS_SCL
SNS_SDA: U10.B5(SDA) ; port CAMERA.SNS_SDA
SNS_SID: R53.1 U10.A6(SID)
SNS_STROBE: R60.2 ; port CAMERA.SNS_STROBE
SNS_VH: C33.1 U10.D1(VH)
SNS_VN: C32.1 U10.D2(VN)
SNS_XSHDN: R51.1 U10.C3(XSHUTDN) ; port CAMERA.SNS_XSHDN  [also labelled SNS_XSHDN_R]
SNS_XSHDN2: R52.1 U10.A2(XSHUTDN2)
SNS_XVCLK: R61.1 R63.2 U10.B4(XVCLK)
XVCLK: R61.2 ; port CAMERA.XVCLK
NetC24_1: C24.1 R54.1 U9.1(OUT)
NetC25_1: C25.1 C30.1 C34.1 Q6.3(D) TP26.TP U9.4(IN) U11.4(IN) U12.3(EN) U12.4(IN)
NetC29_1: C29.1 R56.1 U11.1(OUT)
NetC31_1: C31.1 R57.1 U12.1(OUT)
NetJ1_1: R47.2 R48.1 TP22.TP ; port MIC_CLK
NetJ1_3: R45.2 R46.1 TP23.TP ; port MIC_DATA
NetQ5_1: Q5.1(G) R49.1 R50.2 TP25.TP
NetQ6_1: Q6.1(G) Q7.3(D) R55.2 TP29.TP
NetQ7_1: Q7.1(G) R58.2 R59.1
NetR45_1: R45.1 U6.1(DATA)
NetR46_2: R46.2 U7.1(DATA)
NetR47_1: R47.1 U6.2(CLOCK)
NetR48_2: R48.2 U7.2(CLOCK)
NetR60_1: R60.1 U10.A4(STROBE)
NetR63_1: R63.1 U13.3(OUT)

### Layout directives
differential pair; differential pair class DIFF100: CSI_CLK_N, CSI_CLK_P, CSI_D0_N, CSI_D0_P, CSI_D1_N, CSI_D1_P
net class MIPI CSI: CSI_CLK_N, CSI_CLK_P, CSI_D0_N, CSI_D0_P, CSI_D1_N, CSI_D1_P
net class PWR: AGND, AVDD, DOVDD, DVDD, NetC24_1, NetC25_1, NetC29_1, NetC31_1, VCC5.0, VCC_MIC, VCCA3.3

### Notes on the sheet
- MIC Left
- MIC Right
- Light Sensor
- Disable microphone
- 3.3V
- Disable microphone supply if hardware keypress was detected
- Image Sensor
- Check supply sequencing: AVDD -> DOVDD -> DVDD (Highest to lowest rail voltage)
  Tdelay_min = 0ns
- (near U9) LDO 1.8V
- Disable camera
- (near U11) LDO 1.2V
- (near R60) SCCB device address = 0x20
- (near U12) LDO 2.8V
- Disable camera supply if hardware keypress was detected
- (near U13) CAM CLK 24MHz
- Title:
- Date:
- Time:
- Revision:
- Sheet:
- /
- Engineer
- Checked:
- © OV Tech GmbH - Open Visions Technology
- (in symbol CAP_0201_1uF_6.3V) 0201; X5R
- (in symbol CAP_0201_470nF_10V) 0201; X5R
- (in symbol Crystal Oscillator_ECS-2520MV-240-BN-TR) 24.000MHz
- (in symbol RES_0201_0R_1%) 0201
- (in symbol RES_0201_1.5k_1%) 0201
- (in symbol RES_0201_10k_1%) 0201
- (in symbol RES_0201_18k_1%) 0201
- (in symbol RES_0201_33R_1%) 0201
- (in symbol RES_0201_240R_1%) 0201
- (in symbol RES_0201_OPT) 0201

### Library data of the parts
C22 C23 C26 C27 C35 = CAP_0201_470nF_10V: as C7 on sheet 01 Touch Sensing Keys; Manufacturer 2: TDK
C24 C25 C28-C34 = CAP_0201_1uF_6.3V: Multilayer Ceramic Capacitors MLCC - SMD/SMT 0201 6.3VDC; Manufacturer 1: Murata Electronics; Manufacturer 1 Prt. Nr.: GRM033R60J105MEA2D; Manufacturer 2 Prt. Nr.: CL03A105MQ3CSNC; Manufacturer 2: Samsung Electro-Mechanics
Q5 Q6 = P-Channel MOSFET_SSM3J56ACT,L3F: MOSFET 20V SGL P-CH TRENCHMOS Logic Level; Manufacturer 1: Toshiba; Manufacturer 1 Prt. Nr.: SSM3J56ACT,L3F
Q7 = N-Channel MOSFET_SSM3K15ACT,L3F: as Q1 on sheet 00 Block Diagram; Manufacturer 1 Prt. Nr.: SSM3K15ACT,L3F
R45-R48 R54 R56 R57 R62 = RES_0201_0R_1%: as R9 on sheet 01 Touch Sensing Keys; Manufacturer 2: Vishay / Dale
R49 R55 R59 = RES_0201_18k_1%: as R6 on sheet 00 Block Diagram; Manufacturer 2: KOA Speer
R50 R58 = RES_0201_240R_1%: as R1 on sheet 00 Block Diagram; Manufacturer 2: Vishay / Dale
R51-R53 = RES_0201_1.5k_1%: as R3 on sheet 00 Block Diagram; Manufacturer 2: Vishay / Dale
R60 = RES_0201_10k_1%: Thick Film Resistors - SMD 10K OHM 1%; Manufacturer 1: Yageo; Manufacturer 1 Prt. Nr.: RC0201FR-0710KL; Manufacturer 2 Prt. Nr.: CRCW020110K0FNED; Manufacturer 2: Vishay / Dale
R61 = RES_0201_OPT: Thick Film Resistors - SMD Optinal
R63 = RES_0201_33R_1%: Thick Film Resistors - SMD 33R OHM 1%; Manufacturer 1: Yageo; Manufacturer 1 Prt. Nr.: RC0201FR-0733RL; Manufacturer 2 Prt. Nr.: CRCW020133R0FNED; Manufacturer 2: Vishay / Dale
U6 U7 = Digital Microphone PDM_SPK0641HT4H-1: Digital MEMS Microphone Top Port PDM SPK0641HT4H-1; Manufacturer 1: Knowles; Manufacturer 1 Prt. Nr.: SPK0641HT4H-1
U8 = Light Sensor Module R01: Custom Ambient Light Sensor Module with LGA Footprint
U9 = LDO 1.8V_TLV74018PDQNR: LDO voltage regulator 300mA X2SON; Manufacturer 1: Texas Instruments; Manufacturer 1 Prt. Nr.: TLV74018PDQNR
U10 = Image Sensor_OV2740: MIPI CSI Image Sensor 1080p 1/6"; Manufacturer 1 Prt. Nr.: OmniVision; Manufacturer 1: OV02740-H34A-Z
U11 = LDO 1.2V_TLV74012PDQNR: LDO voltage regulator 300mA X2SON; Manufacturer 1: Texas Instruments; Manufacturer 1 Prt. Nr.: TLV74012PDQNR
U12 = LDO 2.8V_TLV74028PDQNR: LDO voltage regulator 300mA X2SON; Manufacturer 1: Texas Instruments; Manufacturer 1 Prt. Nr.: TLV74028PDQNR
U13 = Crystal Oscillator_ECS-2520MV-240-BN-TR: Crystal Oscillator 2520 miniature SMD package; Manufacturer 1: ECS; Manufacturer 1 Prt. Nr.: ECS-2520MV-240-BN-TR

## Nets that join several sheets
GND: 00 Block Diagram (25 pins), 01 Touch Sensing Keys (31 pins), 02 Sensors (40 pins)
VCC3.3: 00 Block Diagram (C5.1 TP3.TP U2.1), 01 Touch Sensing Keys (18 pins)
VCC5.0: 00 Block Diagram (12 pins), 02 Sensors (Q6.2 R55.1)
VCCA3.3: 00 Block Diagram (C1.1 TP1.TP U1.1), 01 Touch Sensing Keys (7 pins), 02 Sensors (Q5.2 R49.2 U8.1)
CAMERA_ENABLE: 00 Block Diagram (J1.6), 01 Touch Sensing Keys (J17.5 LED5.1 TP16.TP), 02 Sensors (R58.1)
CSI_CLK_N: 00 Block Diagram (J1.37), 02 Sensors (U10.D5)
CSI_CLK_P: 00 Block Diagram (J1.35), 02 Sensors (U10.E5)
CSI_D0_N: 00 Block Diagram (J1.31), 02 Sensors (U10.D4)
CSI_D0_P: 00 Block Diagram (J1.29), 02 Sensors (U10.E4)
CSI_D1_N: 00 Block Diagram (J1.23), 02 Sensors (U10.D6)
CSI_D1_P: 00 Block Diagram (J1.25), 02 Sensors (U10.E6)
GLOBAL_PWM: 00 Block Diagram (J1.10 R4.2), 01 Touch Sensing Keys (R13.2 R25.2 R37.2)
LSNS_SCL: 00 Block Diagram (J1.4), 02 Sensors (U8.6)
LSNS_SDA: 00 Block Diagram (J1.2), 02 Sensors (U8.5)
MIC_DISABLE: 01 Touch Sensing Keys (J21.3 LED8.1), 02 Sensors (R50.1)
NetJ1_1: 00 Block Diagram (J1.1), 02 Sensors (R47.2 R48.1 TP22.TP)
NetJ1_3: 00 Block Diagram (J1.3), 02 Sensors (R45.2 R46.1 TP23.TP)
SNS_FSIN: 00 Block Diagram (J1.14), 02 Sensors (U10.B3)
SNS_GPIO: 00 Block Diagram (J1.22), 02 Sensors (U10.A5)
SNS_PWDNB: 00 Block Diagram (J1.12), 02 Sensors (U10.B2)
SNS_SCL: 00 Block Diagram (J1.24), 02 Sensors (U10.B6)
SNS_SDA: 00 Block Diagram (J1.20), 02 Sensors (U10.B5)
SNS_STROBE: 00 Block Diagram (J1.18), 02 Sensors (R60.2)
SNS_XSHDN: 00 Block Diagram (J1.11), 02 Sensors (R51.1 U10.C3)
WiFi_ENABLE: 00 Block Diagram (J1.8), 01 Touch Sensing Keys (J13.5 LED3.1 TP11.TP)
XVCLK: 00 Block Diagram (J1.16), 02 Sensors (R61.2)